# EAGLE design KM2 (EAGLE 7.6.0)
AUTHOR: Frantisek Burian; DOCNO: KAMBOT-KM2; PROJECT_DESC: KM2 - menic pro dva krokove motory; PROJECT_DETAIL: KM2 - stepper driver; PROJECT_NAME: KAMBot; REVISION: B
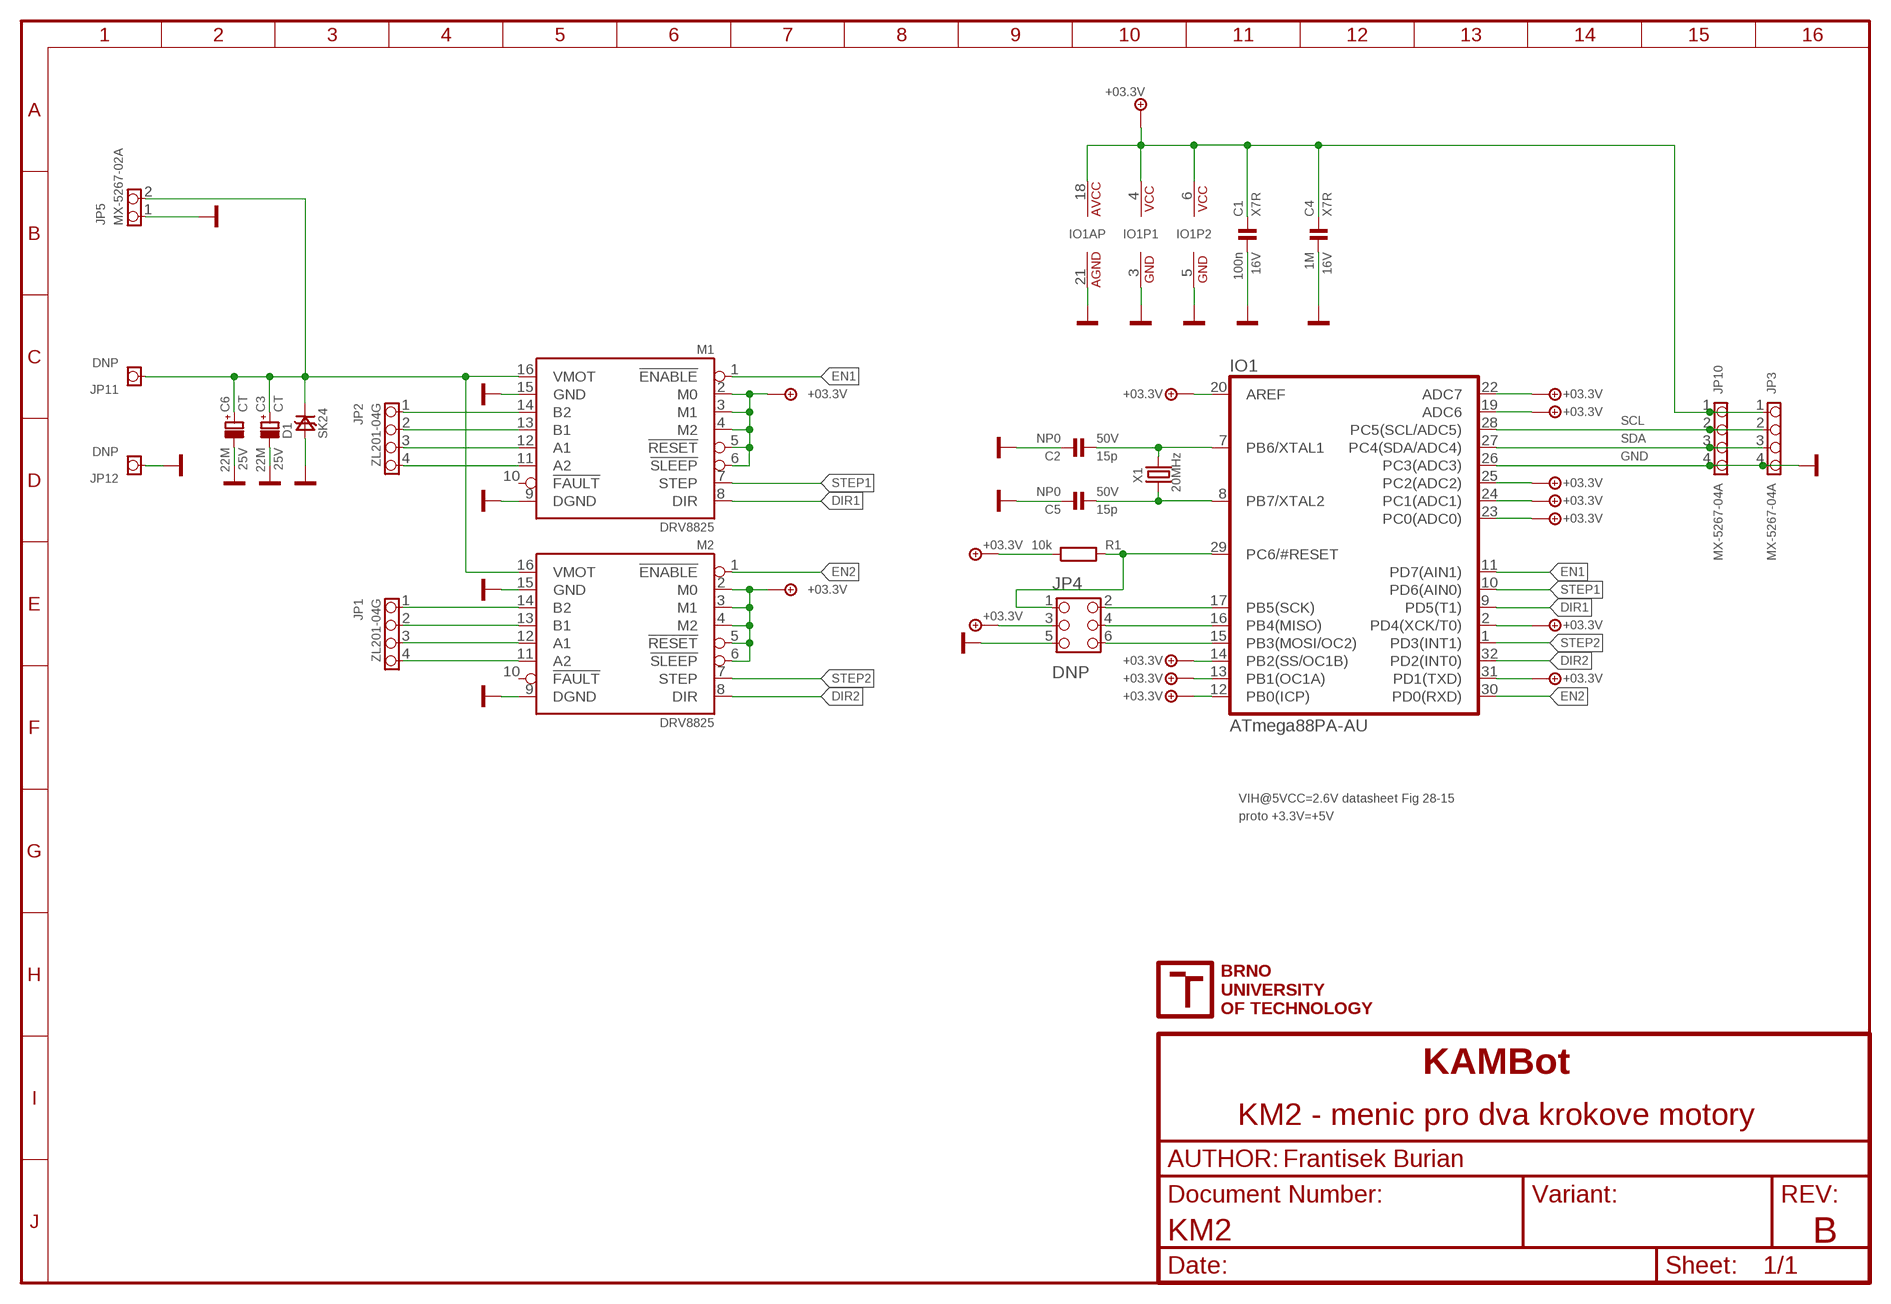
[diagram p0: schematic, sheet 1]

## Parts
C1  100n  C0805  [0805]
C2  15p  C0805  [0805]
C3  22M  CECT7343  [CT7343D]
C4  1M  C0805  [0805]
C5  15p  C0805  [0805]
C6  22M  CECT7343  [CT7343D]
D1  SK24  D_TRANSIL_SMB  [D_SMB]
IO1  ATmega88PA-AU  MEGA8  [TQFP32]
JP1  ZL201-04G  PINHD-1X4_254_H  [1X04_254_MH]
JP2  ZL201-04G  PINHD-1X4_254_H  [1X04_254_MH]
JP3  MX-5267-04A  PINHD-1X4_250_MX5267  [1X04_250_MX5267]
JP4  DNP  PINHD-2X3_254_FP  [2X03_254_FP]
JP5  MX-5267-02A  PINHD-1X2_250_MX5267  [1X02_250_MX5267]
JP10  MX-5267-04A  PINHD-1X4_250_MX5267  [1X04_250_MX5267]
JP11  DNP  PINHD-1X1_254X254PAD  [1X01_254_254_PAD]
JP12  DNP  PINHD-1X1_254X254PAD  [1X01_254_254_PAD]
M1  DRV8825  [MODULE_16P]
M2  DRV8825  [MODULE_16P]
R1  10k  R_R0805  [0805]
X1  20MHz  XHC49  [X_HC49/S]

## Nets
+3.3V: C1.1 C4.1 IO1.2(PD4(XCK/T0)) IO1.4(VCC) IO1.6(VCC) IO1.12(PB0(ICP)) IO1.13(PB1(OC1A)) IO1.14(PB2(SS/OC1B)) IO1.18(VCC) IO1.19(ADC6) IO1.20(AREF) IO1.22(ADC7) IO1.23(PC0(ADC0)) IO1.24(PC1(ADC1)) IO1.25(PC2(ADC2)) IO1.31(PD1(TXD)) JP3.1 JP4.3 JP10.1 M1.2(M0) M1.3(M1) M1.4(M2) M1.5(!RESET) M1.6(!SLEEP) M2.2(M0) M2.3(M1) M2.4(M2) M2.5(!RESET) M2.6(!SLEEP) R1.1 ; supply symbol labelled +03.3V
DIR1: IO1.9(PD5(T1)) M1.8(DIR)
DIR2: IO1.32(PD2(INT0)) M2.8(DIR)
EN1: IO1.11(PD7(AIN1)) M1.1(!ENABLE)
EN2: IO1.30(PD0(RXD)) M2.1(!ENABLE)
GND: C1.2 C2.1 C3.- C4.2 C5.1 C6.- D1.A IO1.3(GND) IO1.5(GND) IO1.21(GND) IO1.26(PC3(ADC3)) JP3.4 JP4.5 JP5.1 JP10.4 JP12.P$1 M1.9(DGND) M1.15(GND) M2.9(DGND) M2.15(GND)
N$1: JP1.1 M2.14(B2)
N$2: JP1.2 M2.13(B1)
N$3: JP1.3 M2.12(A1)
N$4: JP1.4 M2.11(A2)
N$5: JP2.1 M1.14(B2)
N$6: JP2.2 M1.13(B1)
N$7: JP2.3 M1.12(A1)
N$8: JP2.4 M1.11(A2)
N$10: C2.2 IO1.7(PB6/XTAL1) X1.2
N$11: C5.2 IO1.8(PB7/XTAL2) X1.1
N$13: IO1.17(PB5(SCK)) JP4.2
N$14: IO1.16(PB4(MISO)) JP4.4
N$23: IO1.15(PB3(MOSI/OC2)) JP4.6
N$24: IO1.29(PC6/#RESET) JP4.1 R1.2
SCL: IO1.28(PC5(SCL/ADC5)) JP3.2 JP10.2
SDA: IO1.27(PC4(SDA/ADC4)) JP3.3 JP10.3
STEP1: IO1.10(PD6(AIN0)) M1.7(STEP)
STEP2: IO1.1(PD3(INT1)) M2.7(STEP)
VBAT+: C3.+ C6.+ D1.K JP5.2 JP11.P$1 M1.16(VMOT) M2.16(VMOT)
Unconnected: M1.10(!FAULT) M2.10(!FAULT)

## Notes on the sheet
- VIH@5VCC=2.6V datasheet Fig 28-15
- proto +3.3V=+5V

## Library data of the parts
C1 = !discrete:C: Kondenzator; MATERIAL: X7R; PRICE: 0.16; URL: http://www.tme.eu/cz/details/cc0805krx7r9104/kondenzatory-mlcc-smd-0805/yageo/cc0805krx7r9bb104/; VOLTAGE: 16V
C2 C5 = !discrete:C: Kondenzator; MATERIAL: NP0; PRICE: 0.23; URL: http://www.tme.eu/cz/details/c0805c150j5gac/kondenzatory-mlcc-smd-0805/kemet/c0805c150j5gactu/; VOLTAGE: 50V
C3 C6 = !discrete:CE: Kondenzator Elektrolyt; MATERIAL: CT; PRICE: 9.57; URL: http://www.tme.eu/cz/details/t491c226k025at/tantalove-kondenzatory-smd/kemet/; VOLTAGE: 25V
C4 = !discrete:C: Kondenzator; MATERIAL: X7R; PRICE: 0.27; URL: http://www.tme.eu/cz/details/cl21b105kofnnng/kondenzatory-mlcc-smd-0805/samsung/; VOLTAGE: 16V
D1 = !diody:D_TRANSIL: Transil Jednosmerny Typ Urm @ Irm Ubr @ Ibr Ucl @ Ipp Pouzdro SM6T30A 25.6V (1uA) 30V (1mA) 53V (75A) DO214AA (SMB); PRICE: 1.77; URL: http://www.tme.eu/cz/details/sk24-dio/diody-schottky-smd/diotec-semiconductor/sk24/
IO1 = !ic_avr:MEGA8: IO - Mikrokontroler; PRICE: 54.04; URL: http://www.tme.eu/cz/details/atmega88pa-au/mikroprocesory-atmel-avr-smd/atmel/
JP1 JP2 = !pinhead:PINHD-1X4: Konektor 4 PIN Typ Rastr Imax Umax Rmax Kontakt 2.54 mm 500 mA 125 V 50 mOhm krimp /90 2.54 mm 500 mA 125 V 50 mOhm krimp _MX5267 2.50 mm 2.5 A 250 V 20 mOhm krimp _MX53048 1.25 mm 800 mA 125 V 20 mOhm krimp _PV-3.81 3.81 mm 8 A 130 V 30 mOhm ?roub; PRICE: 0.96; URL: http://www.tme.eu/cz/details/zl201-04g/konektory-hrebinky/connfly/ds1021-1_4sf1-1/
JP3 JP10 = !pinhead:PINHD-1X4: Konektor 4 PIN Typ Rastr Imax Umax Rmax Kontakt 2.54 mm 500 mA 125 V 50 mOhm krimp /90 2.54 mm 500 mA 125 V 50 mOhm krimp _MX5267 2.50 mm 2.5 A 250 V 20 mOhm krimp _MX53048 1.25 mm 800 mA 125 V 20 mOhm krimp _PV-3.81 3.81 mm 8 A 130 V 30 mOhm ?roub; PRICE: 2.55; URL: http://www.tme.eu/cz/details/mx-5267-04a/signalove-konektory-raster-250mm/molex/022035045-22-03-5045-5267-04a/
JP4 = !pinhead:PINHD-2X3: Konektor 3 PIN dvourady
JP5 = !pinhead:PINHD-1X2: Konektor Typ Rastr Imax Umax Rmax Kontakt 2.54 mm 500 mA 125 V 50 mOhm krimp /90 2.54 mm 500 mA 125 V 50 mOhm krimp _MX5267 2.50 mm 2.5 A 250 V 20 mOhm krimp _MX53048 1.25 mm 800 mA 125 V 20 mOhm krimp _PV-3.81 3.81 mm 8 A 130 V 30 mOhm ?roub; PRICE: 1.30; URL: http://www.tme.eu/cz/details/mx-5267-02a/signalove-konektory-raster-250mm/molex/022035025-22-03-5025-5267-02a/
JP11 = !pinhead:PINHD-1X1: Konektor Typ Rastr Imax Umax Rmax Kontakt 2.54 mm 500 mA 125 V 50 mOhm krimp /90 2.54 mm 500 mA 125 V 50 mOhm krimp _MX5267 2.50 mm 2.5 A 250 V 20 mOhm krimp _MX53048 1.25 mm 800 mA 125 V 20 mOhm krimp _PV-3.81 3.81 mm 8 A 130 V 30 mOhm sroub WAGO25x 5.08 mm 16 A 250 VAC - pero WAGO25x 7.62 mm 16 A 380 VAC - pero WAGO25x 10.16 mm 16 A 500 VAC - pero; PIN: +VBAT; PRICE: 0.00; URL: -
JP12 = !pinhead:PINHD-1X1: Konektor Typ Rastr Imax Umax Rmax Kontakt 2.54 mm 500 mA 125 V 50 mOhm krimp /90 2.54 mm 500 mA 125 V 50 mOhm krimp _MX5267 2.50 mm 2.5 A 250 V 20 mOhm krimp _MX53048 1.25 mm 800 mA 125 V 20 mOhm krimp _PV-3.81 3.81 mm 8 A 130 V 30 mOhm sroub WAGO25x 5.08 mm 16 A 250 VAC - pero WAGO25x 7.62 mm 16 A 380 VAC - pero WAGO25x 10.16 mm 16 A 500 VAC - pero; PIN: -VBAT; PRICE: 0.00; URL: -
M1 M2 = pololu:DRV8825; PRICE: 181.73; URL: http://www.tme.eu/cz/details/pololu-2133/modulove-ovladace-motoru/pololu/
R1 = !discrete:R_: Rezistor; PRICE: 0.15; URL: http://www.tme.eu/cz/details/rc0805jr-07510k/rezistory-smd-0805/yageo/rc0805jr-07510kl/
X1 = !discrete:X: Krystal; PRICE: 8.45; URL: http://www.tme.eu/cz/details/hc49us-ff3f20.0000/krystalove-rezonatory-tht/ilsi/hc49us-ff3f18-200000/

## Board
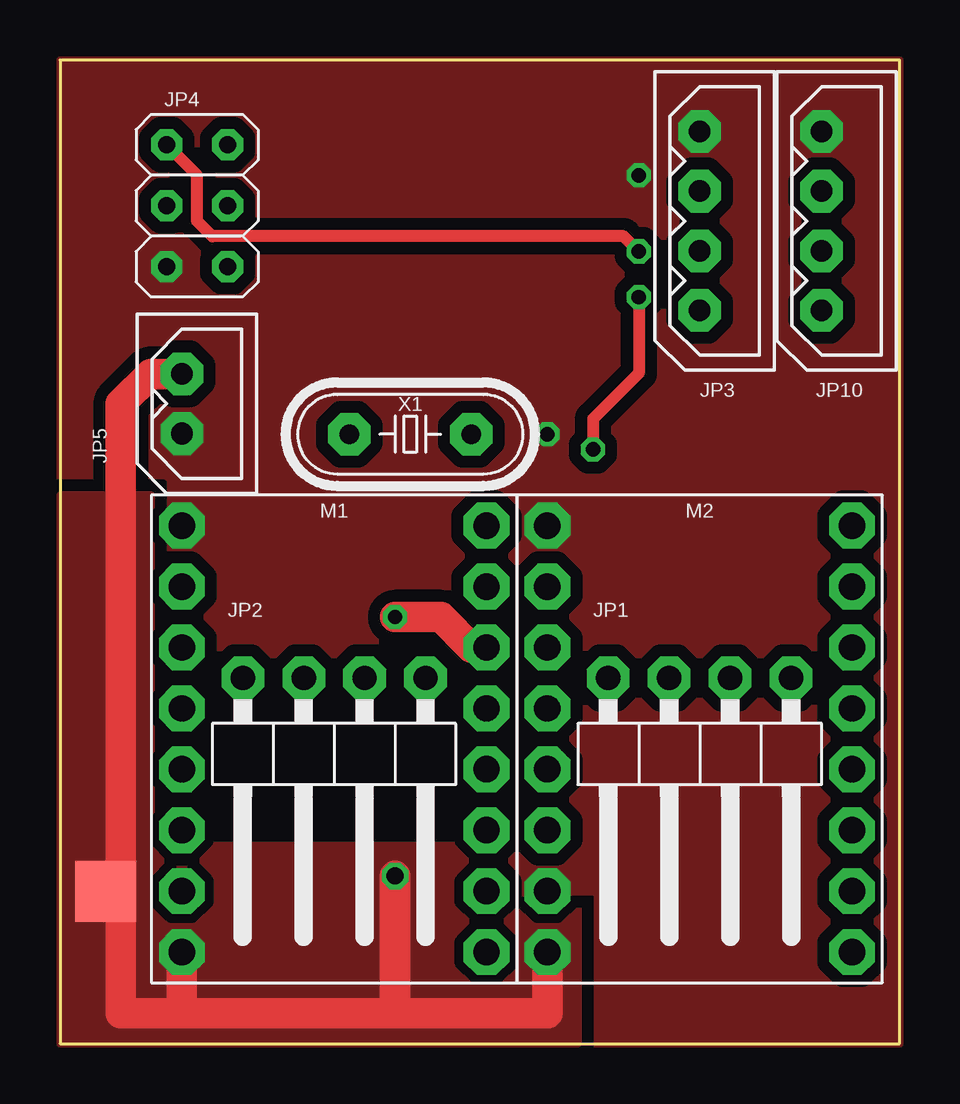
[diagram p1: board, top side]
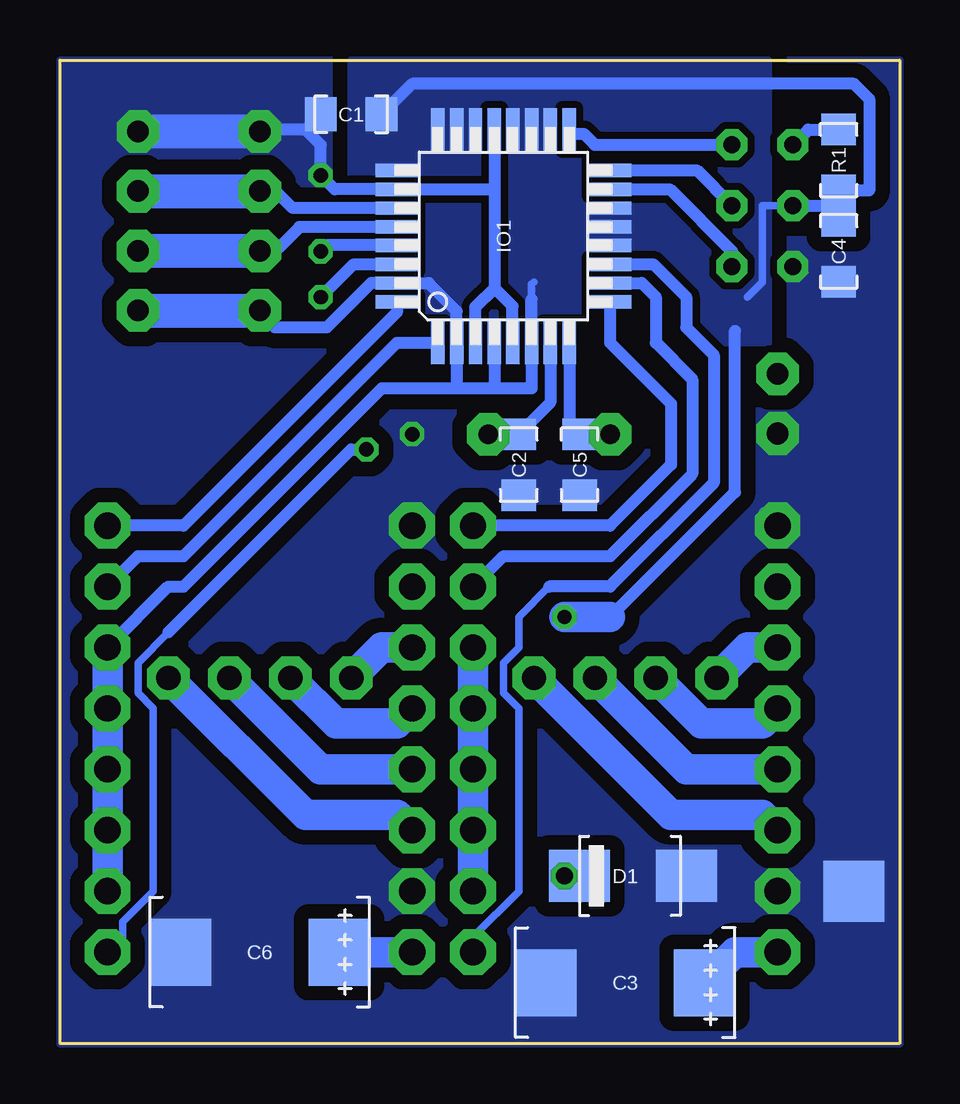
[diagram p2: board, bottom side, seen from below]

Size 35 x 41 mm. Coordinates in mm from the lower left corner, seen from the top.
Outline: 0,0 35,0 35,41 0,41 0,0
Copper layers (1*16): Top 0.035mm / dielectric 1.5mm / Bottom 0.035mm
Design rules "default *": minimum track width 10mil, minimum drill 24mil, track to track 8mil, track to pad 8mil, pad to pad 8mil, via to via 8mil, smd to smd 0mil, copper to edge 0mil, drill to drill 1mil, minimum pad ring 10mil, minimum via ring 8mil, stop-mask expansion 4mil, vias tented up to drill 0.6mm, thermal gap 10mil

### Footprints (pad centres in the part's own frame; a part is rotated, then mirrored left to right if it is on the bottom)
0805 = smd 1.321 x 1.422: 1 -1.27,0; 2 1.27,0
CT7343D = smd 2.54 x 2.794: + -3.302,0; - 3.302,0
D_SMB = smd 2.54 x 2.159: A 2.54,0; K -1.905,0
TQFP32 = smd 1.778 x 0.559: 1 -4.445,2.743; 2 -4.445,1.956; 3 -4.445,1.168; 4 -4.445,0.381; 5 -4.445,-0.381; 6 -4.445,-1.168; 7 -4.445,-1.956; 8 -4.445,-2.743; 17 4.445,-2.743; 18 4.445,-1.956; 19 4.445,-1.168; 20 4.445,-0.381; 21 4.445,0.381; 22 4.445,1.168; 23 4.445,1.956; 24 4.445,2.743 | smd 0.559 x 1.778: 9 -2.743,-4.445; 10 -1.956,-4.445; 11 -1.168,-4.445; 12 -0.381,-4.445; 13 0.381,-4.445; 14 1.168,-4.445; 15 1.956,-4.445; 16 2.743,-4.445; 25 2.743,4.445; 26 1.956,4.445; 27 1.168,4.445; 28 0.381,4.445; 29 -0.381,4.445; 30 -1.168,4.445; 31 -1.956,4.445; 32 -2.743,4.445
1X04_254_MH = drill 1.016 pad 1.778 octagon: 1 -3.81,-3.81; 2 -1.27,-3.81; 3 1.27,-3.81; 4 3.81,-3.81
1X04_250_MX5267 = drill 0.9 pad 1.778 octagon: 1 -3.734,0; 2 -1.245,0; 3 1.245,0; 4 3.734,0
2X03_254_FP = drill 0.7 pad 1.3 octagon: 1 -2.54,-1.27; 2 -2.54,1.27; 3 0,-1.27; 4 0,1.27; 5 2.54,-1.27; 6 2.54,1.27
1X02_250_MX5267 = drill 0.9 pad 1.778 octagon: 1 -1.245,0; 2 1.245,0
1X01_254_254_PAD = smd 2.54 x 2.54: P$1 0,0
MODULE_16P = drill 1.1 pad 1.905 octagon: 1 -6.35,8.89; 2 -6.35,6.35; 3 -6.35,3.81; 4 -6.35,1.27; 5 -6.35,-1.27; 6 -6.35,-3.81; 7 -6.35,-6.35; 8 -6.35,-8.89; 9 6.35,-8.89; 10 6.35,-6.35; 11 6.35,-3.81; 12 6.35,-1.27; 13 6.35,1.27; 14 6.35,3.81; 15 6.35,6.35; 16 6.35,8.89
X_HC49/S = drill 0.8 pad 1.778 octagon: 1 -2.54,0; 2 2.54,0

### Placement (x,y rotation side)
C1  22.86,38.73 180 bottom
C2  15.88,24.13 90 bottom
C3  11.43,2.54 180 bottom
C4  2.54,33.02 270 bottom
C5  13.34,24.13 90 bottom
C6  26.67,3.81 180 bottom
D1  11.43,6.99 0 bottom
IO1  16.51,33.66 90 bottom
JP1  26.67,11.43 180 top
JP2  11.43,11.43 180 top
JP3  26.67,34.29 90 top
JP4  5.71,34.92 270 top
JP5  5.08,26.67 90 top
JP10  31.75,34.29 90 top
JP11  1.91,6.35 180 top
JP12  1.91,6.35 180 bottom
M1  11.43,12.7 180 top
M2  26.67,12.7 180 top
R1  2.54,36.83 90 bottom
U$1  [DIN_A4_1:2]  -24.13,-60.96 0 top  (outside the outline)
U$2  [RAZITKO_1:2]  15.24,-60.96 0 top  (outside the outline)
U$3  [VUT_LOGO]  17.78,-38.1 0 top  (outside the outline)
X1  14.61,25.4 0 top

### Tracks (layer width: path | path; a pad name or v marks a point on that pad's centre or on a via)
+3.3V  (via drill 0.6)
  Top 1.27: M1.6 17.14,16.51 15.88,17.78 v13.97,17.78
  Bottom 0.305: 15.34,27.3 15.34,31.65 15.24,31.75 | JP4.3 5.71,34.92 5.71,31.75 6.35,31.11
  Bottom 0.508: C1.1 20.32,40.01 1.91,40.01 1.27,39.37 1.27,35.56 R1.1 2.54,34.92 | 15.34,31.01 IO1.6 15.34,27.3 16.89,27.3 | 16.89,27.3 18.47,27.3 | 18.47,27.3 IO1.2 18.47,30.53 19.63,31.7 IO1.31 22.02,31.7 23.88,29.84 26.04,29.84 26.67,30.48 JP3.1 | IO1.4 16.89,27.3 | 12.06,17.78 6.86,22.99 6.86,29.72 | M2.6 30.48,19.05 29.84,19.05 21.59,27.3 18.47,27.3 | C4.1 2.54,34.92 | JP4.3 2.54,34.92
  Bottom 1.27: M2.2 M2.3 M2.4 M2.5 M2.6 | M1.2 M1.3 M1.4 M1.5 M1.6 | v13.97,17.78 12.06,17.78
  Bottom 1.422: JP10.1 JP3.1
  pour Bottom (isolate 0.305, no thermals): 5.46,41 22.86,41 22.86,36.2 19.68,36.2 19.68,29.21 5.46,29.21
DIR1
  Bottom 0.508: M1.8 12.06,21.59 9.53,24.13 9.53,26.67 12.06,29.21 IO1.9
DIR2
  Bottom 0.508: IO1.32 20.95,30.48 29.84,21.59 M2.8
EN1
  Bottom 0.305: M1.1 17.78,4.45 15.88,6.35 15.88,13.97 16.51,14.61 16.51,15.88 15.88,16.51 15.88,17.78 14.61,19.05
  Bottom 0.508: IO1.11 10.26,32.49 8.89,31.11 8.89,29.84 7.75,28.7 7.75,23.37 12.06,19.05 14.61,19.05
EN2  (via drill 0.6)
  Top 0.508: v24.13,31.11 24.13,27.94 22.23,26.04 v22.23,24.77
  Bottom 0.305: 30.48,17.14 31.75,15.88 31.75,14.61 31.11,13.97 31.11,6.35 32.38,5.08 32.38,4.45 M2.1
  Bottom 0.508: v24.13,31.11 22.76,32.49 IO1.30 | 30.48,17.14 22.86,24.77 v22.23,24.77
GND  (via drill 0.6)
  Bottom 0.508: IO1.5 16.13,30.73 16.89,31.5 | IO1.21 16.89,35.56 | 16.89,35.56 16.89,31.5 | 16.89,35.56 16.94,35.61 IO1.26 23.55,35.61 v24.13,36.2 24.13,37.47 24.77,38.1 | IO1.3 17.68,30.71 16.89,31.5 | 5.62,22.13 M1.9 | 24.77,38.1 26.59,38.1 JP3.4 | C1.2 24.77,38.1
  Bottom 1.422: JP10.4 JP3.4
  other vias: 20.32,25.4
  pour Top (isolate 0.508, rank 6, no thermals): 0,0 35,0 35,41 0,41
  pour Top (no thermals): 10.18,41 10.18,36.54 23.18,36.54 23.18,41
  pour Bottom (isolate 0.61, rank 6, no thermals): 35,0 35,41 0,41 0,0
N$1
  Bottom 1.27: JP1.1 24.77,9.53 20.95,9.53 M2.14
N$2
  Bottom 1.27: JP1.2 24.13,11.43 M2.13
N$3
  Bottom 1.27: JP1.3 23.5,13.34 20.95,13.34 M2.12
N$4
  Bottom 1.27: JP1.4 21.59,16.51 M2.11
N$5
  Bottom 1.27: JP2.1 9.53,9.53 5.71,9.53 M1.14
N$6
  Bottom 1.27: JP2.2 8.89,11.43 M1.13
N$7
  Bottom 1.27: JP2.3 8.26,13.34 5.71,13.34 M1.12
N$8
  Bottom 1.27: JP2.4 6.35,16.51 M1.11
N$10
  Bottom 0.508: IO1.7 14.55,26.72 C2.2 X1.2
N$11
  Bottom 0.508: IO1.8 13.77,25.4 C5.2 X1.1
N$13
  Bottom 0.508: IO1.17 13.59,37.92 13.16,37.92 12.7,37.47 JP4.2
N$14
  Bottom 0.508: IO1.16 8.46,36.4 JP4.4
N$23
  Bottom 0.508: IO1.15 9.58,35.61 6.99,33.02 JP4.6
N$24  (via drill 0.6)
  Top 0.508: v24.13,33.02 23.5,33.66 6.35,33.66 5.71,34.29 5.71,36.2 JP4.1
  Bottom 0.508: IO1.29 23.88,33.27 v24.13,33.02 | JP4.1 3.81,38.1 R1.2
SCL
  Bottom 0.508: IO1.28 25.02,34.04 26.04,33.02 26.64,33.02 JP3.2
  Bottom 1.422: JP10.2 JP3.2
SDA
  Bottom 0.508: IO1.27 25.3,34.82 26.04,35.56 26.64,35.56 JP3.3
  Bottom 1.422: JP10.3 JP3.3
STEP1
  Bottom 0.508: IO1.10 10.74,31.7 10.16,31.11 10.16,29.21 8.64,27.69 8.64,23.75 12.06,20.32 16.51,20.32 M1.7
STEP2
  Bottom 0.508: M2.7 31.75,20.32 29.84,20.32 20.95,29.21 IO1.1
VBAT+  (via drill 0.7)
  Top 1.27: 5.08,1.27 2.54,1.27 2.54,26.67 3.79,27.91 JP5.2 | 5.08,1.27 13.97,1.27 | 13.97,1.27 20.32,1.27 M2.16 | M1.16 5.08,1.27 | v13.97,6.99 13.97,1.27
  Bottom 1.27: C3.+ 6.86,3.81 M1.16 | C6.+ M2.16 | D1.K v13.97,6.99
  pour Top (isolate 0.381, no thermals): 21.59,8.26 21.59,0 0,0 0,22.86 3.81,22.86 3.81,8.26

### Text on the board
tRestrict: KM2-B
tDocu: KM2-B | UAMT FEKT VUT | UAMT | FEKT | BUT | BAT+